# Altium schematic sheet Data_Conversion.SchDoc
size A; DocumentNumber: 4; SheetNumber: 4; SheetTotal: 5
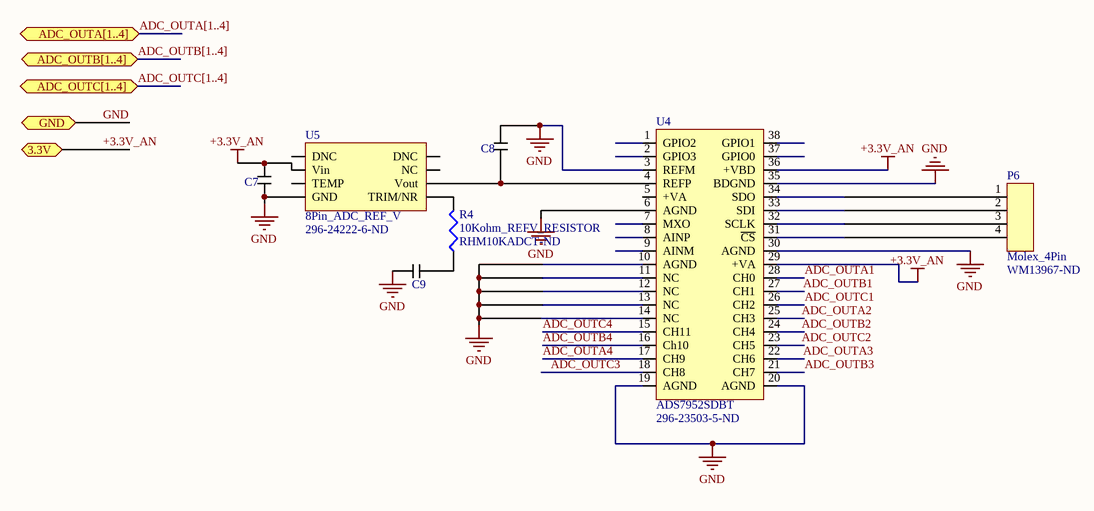
[diagram p0: Data_Conversion.SchDoc]

## Parts
C7  0.1uF Cap  [0.1uF_Kemet]  (value not drawn)
C8  0.1uF Cap  [0.1uF_Kemet]  (value not drawn)
C9  0.1uF Cap  [0.1uF_Kemet]  (value not drawn)
P6  Molex_4Pin  Supplier Part Number 1: WM13967-ND  [MUX_SEL_CON]
R4  10Kohm_REFV_RESISTOR  Supplier Part Number 1: RHM10KADCT-ND  [REFV_10K_RES]
U4  ADS7952SDBT  Supplier Part Number 1: 296-23503-5-ND  [TSSOP50P640X120-38N]
U5  8Pin_ADC_REF_V  Supplier Part Number 1: 296-24222-6-ND  [SOIC127P600X175-8N]

## Ports
3.3V (bidir), ADC_OUTA[1..4] (bidir), ADC_OUTB[1..4] (bidir), ADC_OUTC[1..4] (bidir), GND (bidir)

## Nets
+3.3V_AN: C7.2 U4.29(+VA) U4.36(+VBD) U5.2(Vin) ; port 3.3V
GND: C7.1 C8.2 C9.2 U4.3(REFM) U4.6(AGND) U4.10(AGND) U4.11(NC) U4.12(NC) U4.13(NC) U4.14(NC) U4.19(AGND) U4.20(AGND) U4.30(AGND) U4.35(BDGND) U5.4(GND) ; port GND
ADC_OUTA1: U4.28(CH0)
ADC_OUTA2: U4.25(CH3)
ADC_OUTA3: U4.22(CH6)
ADC_OUTA4: U4.17(CH9)
ADC_OUTB1: U4.27(CH1)
ADC_OUTB2: U4.24(CH4)
ADC_OUTB3: U4.21(CH7)
ADC_OUTB4: U4.16(Ch10)
ADC_OUTC1: U4.26(CH2)
ADC_OUTC2: U4.23(CH5)
ADC_OUTC3: U4.18(CH8)
ADC_OUTC4: U4.15(CH11)
NetC8_1: C8.1 U4.4(REFP) U5.6(Vout)
NetC9_1: C9.1 R4.4-1
NetP6_1: P6.1 U4.34(SDO)
NetP6_2: P6.2 U4.33(SDI)
NetP6_3: P6.3 U4.32(SCLK)
NetP6_4: P6.4 U4.31(~{CS})
NetR4_4-2: R4.4-2 U5.5(TRIM/NR)

Not connected (* = marked no-connect by the designer): U4 1(GPIO2) 2(GPIO3) 5(+VA) 7(MXO) 8(AINP) 9(AINM) 37(GPIO0) 38(GPIO1); U5 1(DNC) 3(TEMP) 7(NC) 8(DNC)

## Buses and harness runs
bus ADC_OUTA[1..4] = port ADC_OUTA[1..4]
bus ADC_OUTB[1..4] = port ADC_OUTB[1..4]
bus ADC_OUTC[1..4] = port ADC_OUTC[1..4]

## Library data of the parts
C7-C9 = 0.1uF Cap: C0603C101K8GAC7867 Kemet Capacitor; Supplier 1: Digi-Key; Supplier Part Number 1: 399-14477-1-ND
P6 = Component_1_2: Supplier 1: Digi-Key
R4 = 10Kohm_REFV_RESISTOR: Manufacturer: Rohm; Manufacturer Part Number: ESR03EZPF1002; Tolerance: 1%; Resistance: 10kR; Power Rating: 250mW; Temperature Coefficient: 100ppm/°C; Supplier 1: Digi-Key; Stock 1: 250527; Pricing 1: 1=0.14, 10=0.126, 100=0.0484, 1000=0.0213, 2500=0.0184 (USD); Case/Package: 0603; Case Code (Metric): 1608; Case Code (Imperial): 0603; Min Operating Temperature: -55°C; Max Operating Temperature: 155°C; Package Quantity: 1; Packaging: Tape and Reel; Composition: Thick Film; Number of Terminations: 2; Max Power Dissipation: 250mW; Features: Automotive AEC-Q200; Length: 0.063inch; Height: 0.022inch; Width: 0.031inch; Lead Free: Lead Free; ComponentLink1URL: https://www.rohm.com/datasheet/ESR01MZPF/esr-e; ComponentLink1Description: https://www.rohm.com/datasheet/ESR01MZPF/esr-e
U5 = 8Pin_ADC_REF_V: Manufacturer: Texas Instruments; Manufacturer Part Number: REF5025AQDRQ1; Max Input Voltage: 18V; Output Voltage: 2.5V; Min Input Voltage: 2.7V; Nominal Supply Current: 800uA; Tolerance: 0.1%; Max Output Current: 10mA; Operating Supply Current: 1.2mA; Temperature Coefficient: 3ppm/°C; Reference Type: Series; Output Type: Fixed; Supplier 1: Digi-Key; Stock 1: 2420; Pricing 1: 1=3.54, 10=3.182, 100=2.607, 500=2.2193, 1000=1.8717 (USD); Case/Package: D; Number of Pins: 8; Weight: 0.002677oz; Min Operating Temperature: -40°C; Max Operating Temperature: 125°C; Packaging: Tape and Reel; Package Quantity: 1; Min Output Voltage: 2.5V; Output Current: 10mA; Max Output Voltage: 2.5V; Quiescent Current: 800uA; Radiation Hardening: No; Lead Free: Lead Free; ComponentLink1URL: http://www.ti.com/lit/ds/symlink/ref5025a-q1.pdf; ComponentLink1Description: http://www.ti.com/lit/ds/symlink/ref5025a-q1.pdf
U4 = ADS7952SDBT: Supplier 1: Digi-Key